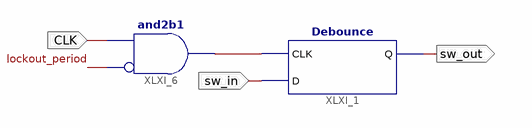
[diagram p0: schematic sheet 1]
// Xilinx ISE schematic switch_debounce.sch (spartan3e) as structural Verilog: 2 symbols, 3 ports
module switch_debounce (
  input  sw_in,
  input  CLK,
  output sw_out
);

  wire lockout_period, XLXN_36;

  Debounce XLXI_1 (.CLK(XLXN_36), .D(sw_in), .Q(sw_out));
  and XLXI_6 (XLXN_36, ~lockout_period, CLK);  // and2b1
endmodule
